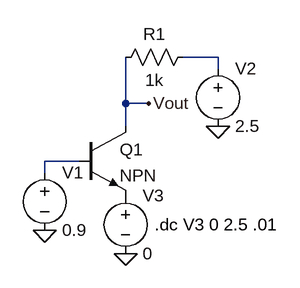
[diagram p0: schematic tut2 Q3.asc]
tut2 Q3.asc, the LTspice schematic file:
Version 4
SHEET 1 880 680
WIRE 224 48 176 48
WIRE 224 64 224 48
WIRE 96 112 96 48
WIRE 128 112 96 112
WIRE 96 144 96 112
WIRE 32 192 -16 192
WIRE -16 208 -16 192
FLAG 96 320 0
FLAG -16 288 0
FLAG 224 144 0
FLAG 128 112 Vout
SYMBOL voltage -16 192 R0
WINDOW 123 0 0 Left 2
WINDOW 39 0 0 Left 2
SYMATTR InstName V1
SYMATTR Value 0.9
SYMBOL voltage 224 48 R0
WINDOW 123 0 0 Left 2
WINDOW 39 0 0 Left 2
SYMATTR InstName V2
SYMATTR Value 2.5
SYMBOL voltage 96 224 R0
WINDOW 123 0 0 Left 2
WINDOW 39 0 0 Left 2
SYMATTR InstName V3
SYMATTR Value 0
SYMBOL npn 32 144 R0
SYMATTR InstName Q1
SYMBOL res 192 32 R90
WINDOW 0 0 56 VBottom 2
WINDOW 3 32 56 VTop 2
SYMATTR InstName R1
SYMATTR Value 1k
TEXT 136 280 Left 2 !.dc V3 0 2.5 .01

The netlist it stands for:
* tut2 Q3.asc
V1 N002 0 0.9
V2 N001 0 2.5
V3 P001 0 0
Q1 Vout N002 P001 0 NPN
R1 N001 Vout 1k
.model NPN NPN
.model PNP PNP
.lib standard.bjt
.dc V3 0 2.5 .01
.backanno
.end

* Results of the author's LTspice run, read from the files saved beside the schematic
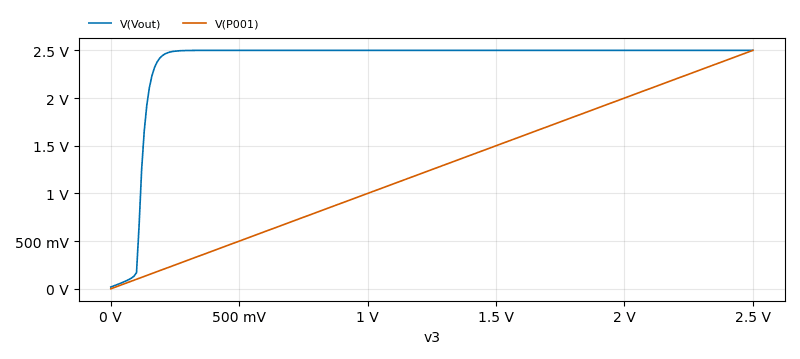
[diagram p1: DC transfer characteristic of tut2 Q3.asc, plotted from the saved traces]
* DC transfer characteristic, 1 run:
*   V(Vout): 18.43 mV at v3=0 V, 2.5 V at v3=2.5 V, min 18.43 mV, max 2.5 V
*   V(P001): 0 V at v3=0 V, 2.5 V at v3=2.5 V, min 0 V, max 2.5 V